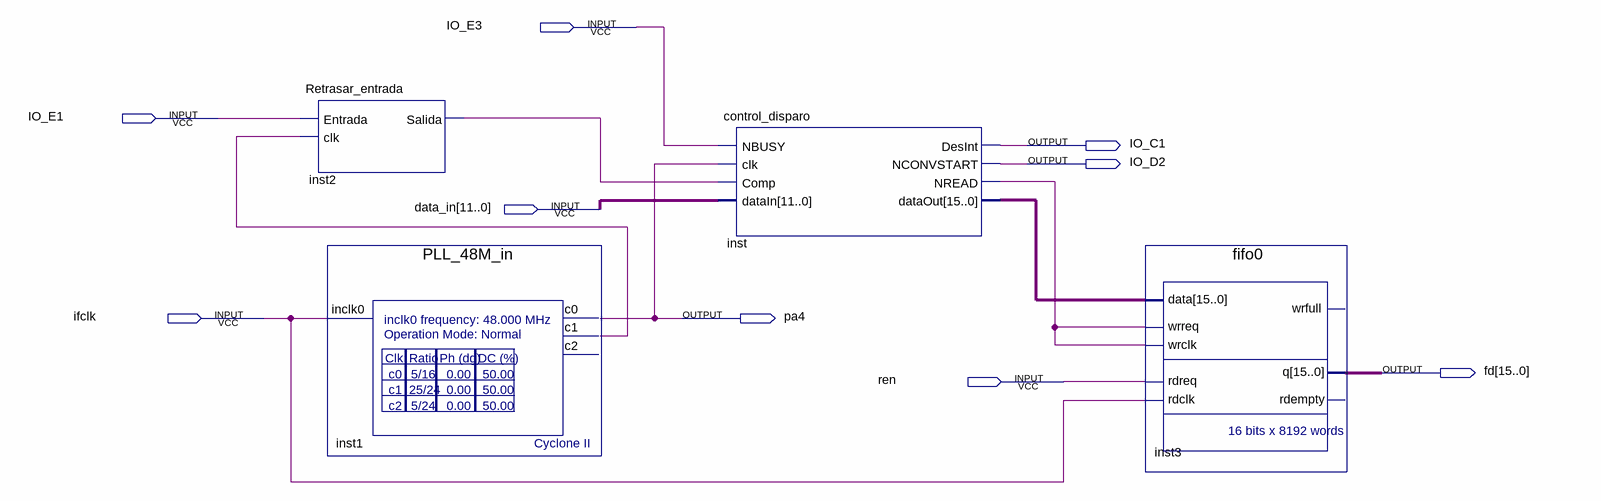
[diagram p0: schematic sheet]
// Quartus schematic Template.bdf as structural Verilog: 4 symbols, 9 pins
module Template (
  input  IO_E3,
  input  IO_E1,
  input  [11:0] data_in,
  input  ifclk,
  input  ren,
  output IO_C1,
  output IO_D2,
  output pa4,
  output [15:0] fd
);

  wire inst1_c1, inst2_salida, inst_nread;
  wire [15:0] inst_dataout;

  Retrasar_entrada inst2 (.Entrada(IO_E1), .clk(inst1_c1), .Salida(inst2_salida));
  PLL_48M_in inst1 (.inclk0(ifclk), .c0(pa4), .c1(inst1_c1));  // open: c2
  control_disparo inst (
    .NBUSY(IO_E3), .clk(pa4), .Comp(inst2_salida), .dataIn(data_in), .DesInt(IO_C1), .NCONVSTART(IO_D2),
    .NREAD(inst_nread), .dataOut(inst_dataout));
  fifo0 inst3 (
    .data(inst_dataout), .wrreq(inst_nread), .wrclk(inst_nread), .rdreq(ren), .rdclk(ifclk), .q(fd));  // open: wrfull, rdempty
endmodule
